# EAGLE design capv0 (EAGLE 6.5.0)
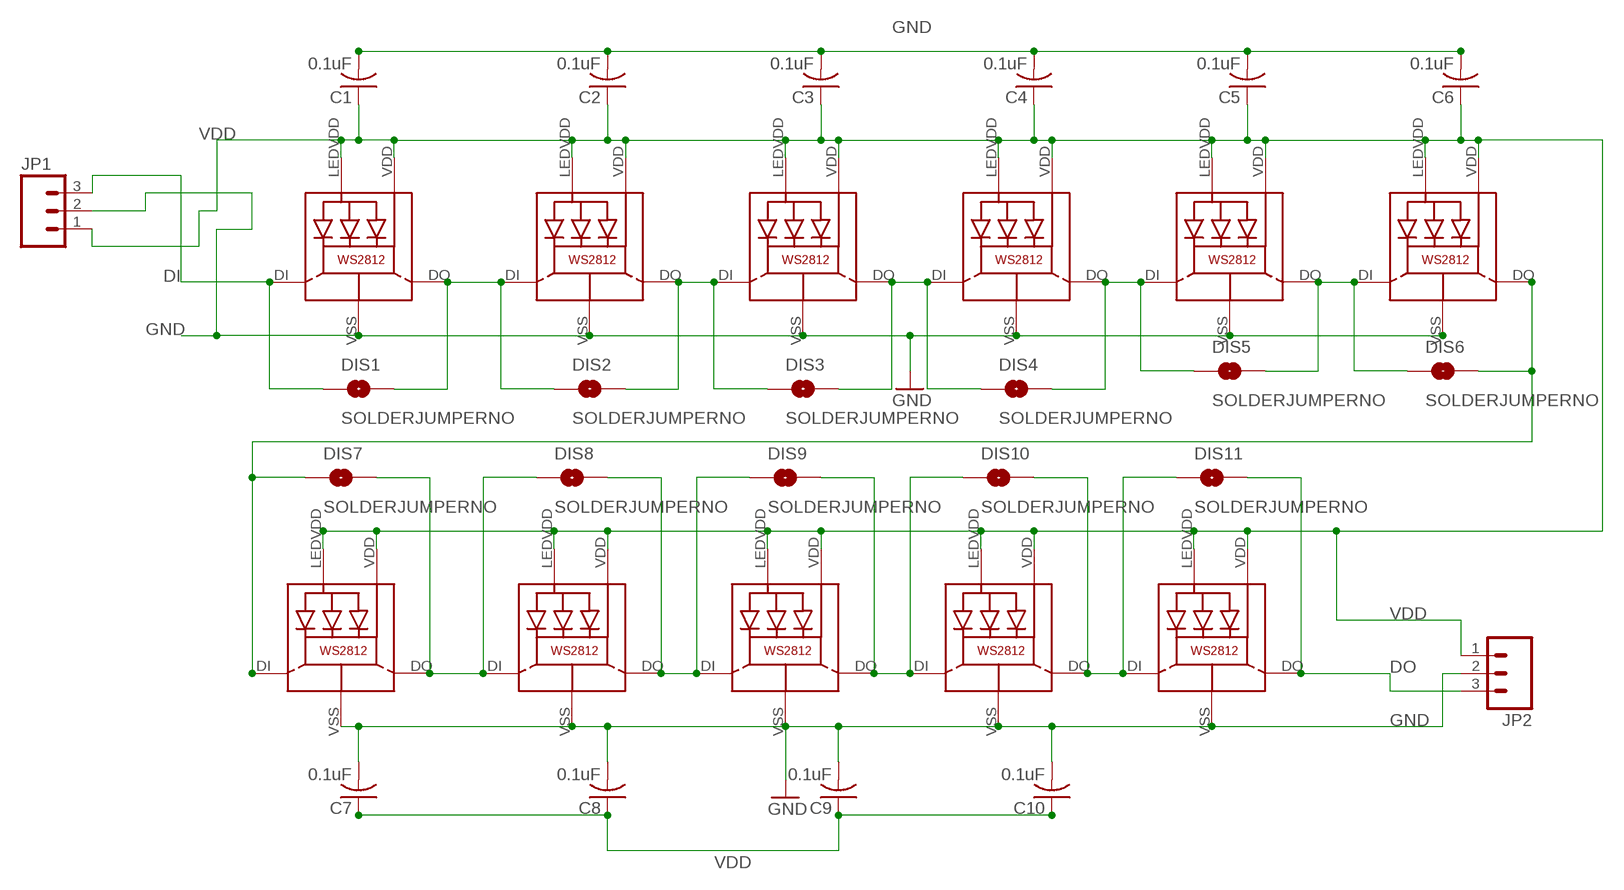
[diagram p0: schematic, sheet 1]

## Parts
C1  0.1uF  C-USC0805  [C0805]
C2  0.1uF  C-USC0805  [C0805]
C3  0.1uF  C-USC0805  [C0805]
C4  0.1uF  C-USC0805  [C0805]
C5  0.1uF  C-USC0805  [C0805]
C6  0.1uF  C-USC0805  [C0805]
C7  0.1uF  C-USC0805  [C0805]
C8  0.1uF  C-USC0805  [C0805]
C9  0.1uF  C-USC0805  [C0805]
C10  0.1uF  C-USC0805  [C0805]
DIS1  SOLDERJUMPERNO  [SJ_2S-NO]
DIS2  SOLDERJUMPERNO  [SJ_2S-NO]
DIS3  SOLDERJUMPERNO  [SJ_2S-NO]
DIS4  SOLDERJUMPERNO  [SJ_2S-NO]
DIS5  SOLDERJUMPERNO  [SJ_2S-NO]
DIS6  SOLDERJUMPERNO  [SJ_2S-NO]
DIS7  SOLDERJUMPERNO  [SJ_2S-NO]
DIS8  SOLDERJUMPERNO  [SJ_2S-NO]
DIS9  SOLDERJUMPERNO  [SJ_2S-NO]
DIS10  SOLDERJUMPERNO  [SJ_2S-NO]
DIS11  SOLDERJUMPERNO  [SJ_2S-NO]
JP1  M03LOCK  [1X03_LOCK]
JP2  M03LOCK  [1X03_LOCK]
LED1  WS2812  [WS2812]
LED2  WS2812  [WS2812]
LED3  WS2812  [WS2812]
LED4  WS2812  [WS2812]
LED5  WS2812  [WS2812]
LED6  WS2812  [WS2812]
LED7  WS2812  [WS2812]
LED8  WS2812  [WS2812]
LED9  WS2812  [WS2812]
LED10  WS2812  [WS2812]
LED11  WS2812  [WS2812]

## Nets
DI: DIS1.1 JP1.3 LED1.DI
DO: DIS11.2 JP2.3 LED11.DO
GND: C1.2 C2.2 C3.2 C4.2 C5.2 C6.2 C7.2 C8.2 C9.2 C10.2 JP1.2 JP2.2 LED1.VSS(GND) LED2.VSS(GND) LED3.VSS(GND) LED4.VSS(GND) LED5.VSS(GND) LED6.VSS(GND) LED7.VSS(GND) LED8.VSS(GND) LED10.VSS(GND) LED11.VSS(GND)
N$1: DIS1.2 DIS2.1 LED1.DO LED2.DI
N$2: DIS2.2 DIS3.1 LED2.DO LED3.DI
N$3: DIS3.2 DIS4.1 LED3.DO LED4.DI
N$4: DIS4.2 DIS5.1 LED4.DO LED5.DI
N$5: DIS5.2 DIS6.1 LED5.DO LED6.DI
N$6: DIS6.2 DIS7.1 LED6.DO LED7.DI
N$7: DIS7.2 DIS8.1 LED7.DO LED8.DI
N$8: DIS8.2 DIS9.1 LED8.DO LED9.DI
N$9: DIS9.2 DIS10.1 LED9.DO LED10.DI
N$10: DIS10.2 DIS11.1 LED10.DO LED11.DI
VDD: C1.1 C2.1 C3.1 C4.1 C5.1 C6.1 C7.1 C8.1 C9.1 C10.1 JP1.1 JP2.1 LED1.LEDVDD LED1.VDD LED2.LEDVDD LED2.VDD LED3.LEDVDD LED3.VDD LED4.LEDVDD LED4.VDD LED5.LEDVDD LED5.VDD LED6.LEDVDD LED6.VDD LED7.LEDVDD LED7.VDD LED8.LEDVDD LED8.VDD LED9.LEDVDD LED9.VDD LED10.LEDVDD LED10.VDD LED11.LEDVDD LED11.VDD

## Power pins joined to a net without a drawn wire
GND: LED9.VSS(GND)

## Library data of the parts
C1-C10 = adafruit:C-US: CAPACITOR, American symbol
DIS1-DIS11 = SparkFun-Passives:SOLDERJUMPER: Solder Jumper Standard SMD solder jumper. Used to automate production. Two varients : Normally Open and Normally Closed are the same, but have different paste layers. NC will have a large amount of paste and should jumper during reflow.
JP1 JP2 = SparkFun-Connectors:M03: Header 3 Standard 3-pin 0.1" header. Use with straight break away headers (SKU : PRT-00116), right angle break away headers (PRT-00553), swiss pins (PRT-00743), machine pins (PRT-00117), and female headers (PRT-00115). Molex polarized connector foot print use with SKU : PRT-08232 with associated crimp pins and housings.
LED1-LED11 = adafruit:WS2812

## Board
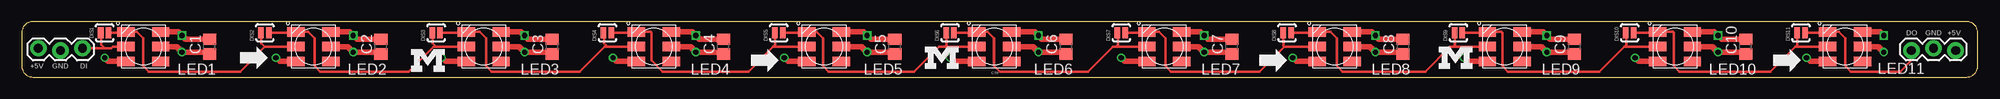
[diagram p1: board, top side]
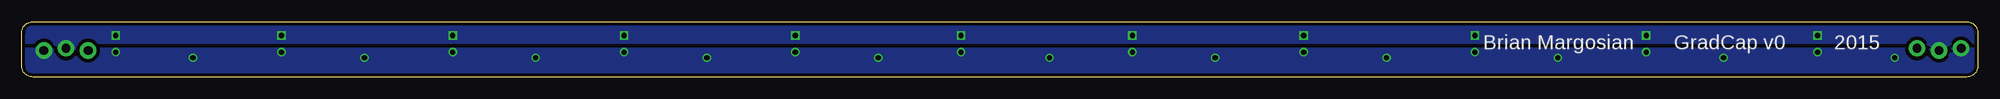
[diagram p2: board, bottom side, seen from below]

Size 224.79 x 6.35 mm. Coordinates in mm from the lower left corner, seen from the top.
Outline: 0,5.08 0,1.27 arc90 1.27,0 223.52,0 arc90 224.79,1.27 224.79,5.08 arc90 223.52,6.35 1.27,6.35 arc90 0,5.08
Copper layers (1*16): Top 0.0356mm / dielectric 1.5011mm / Bottom 0.0356mm
Design rules "OshPark2014": minimum track width 6mil, minimum drill 13mil, track to track 6mil, track to pad 6mil, pad to pad 6mil, via to via 6mil, smd to smd 6mil, copper to edge 15mil, drill to drill 6mil, minimum pad ring 7mil, minimum via ring 7mil, stop-mask expansion 3mil, vias tented up to drill 0mil, thermal gap 10mil

### Footprints (pad centres in the part's own frame; a part is rotated, then mirrored left to right if it is on the bottom)
C0805 = smd 1.3 x 1.5: 1 -0.85,0; 2 0.85,0
SJ_2S-NO = smd 0.635 x 1.27: 1 -0.45,0; 2 0.45,0
1X03_LOCK = drill 1.016 pad 1.88: 1 0,0.127; 2 2.54,-0.127; 3 5.08,0.127
WS2812 = smd 2 x 1.1: DI 2,0; DO 2,-1.7; LEDVDD -2,0; NC -2,1.7; VDD 2,1.7; VSS -2,-1.7

### Placement (x,y rotation side)
C1  21.59,3.49 90 top
C2  41.27,3.49 90 top
C3  60.96,3.49 90 top
C4  80.64,3.49 90 top
C5  100.33,3.49 90 top
C6  120.02,3.49 90 top
C7  139.06,3.49 90 top
C8  158.75,3.49 90 top
C9  178.44,3.49 90 top
C10  198.12,3.49 90 top
DIS1  9.53,5.08 0 top
DIS2  27.94,5.08 0 top
DIS3  47.62,5.08 0 top
DIS4  67.31,5.08 0 top
DIS5  87,5.08 0 top
DIS6  106.68,5.08 0 top
DIS7  126.36,5.08 0 top
DIS8  145.41,5.08 0 top
DIS9  165.1,5.08 0 top
DIS10  184.78,5.08 0 top
DIS11  204.47,5.08 0 top
JP1  1.91,3.17 0 top
JP2  222.25,3.17 180 top
LED1  13.97,3.49 180 top
LED2  33.53,3.49 180 top
LED3  53.09,3.49 180 top
LED4  72.64,3.49 180 top
LED5  92.2,3.49 180 top
LED6  111.76,3.49 180 top
LED7  131.32,3.49 180 top
LED8  150.88,3.49 180 top
LED9  170.43,3.49 180 top
LED10  189.99,3.49 180 top
LED11  209.55,3.49 180 top

### Tracks (layer width: path | path; a pad name or v marks a point on that pad's centre or on a via)
DI
  Top 0.305: JP1.3 9.53,3.3 | 9.53,3.3 10.29,3.3 10.48,3.49 LED1.DI | DIS1.1 9.12,3.7 9.53,3.3
DO
  Top 0.305: JP2.3 217.17,1.91 215.9,0.64 210.19,0.64 209.55,1.27 209.55,4.45 208.8,5.19 LED11.DO 207.44,5.08 DIS11.2
GND  (via drill 0.6)
  Top 0.61: LED1.VSS 17.98,5.19 v18.41,4.76 18.84,4.34 C1.2 | LED2.VSS 37.67,5.19 v38.1,4.76 38.52,4.34 C2.2 | LED3.VSS 57.35,5.19 v57.78,4.76 58.2,4.34 C3.2 | LED4.VSS 77.04,5.19 v77.47,4.76 77.89,4.34 C4.2 | LED5.VSS 96.72,5.19 v97.16,4.76 97.58,4.34 C5.2 | LED6.VSS 116.41,5.19 v116.84,4.76 117.26,4.34 C6.2 | LED7.VSS 135.46,5.19 v135.89,4.76 136.31,4.34 C7.2 | LED8.VSS 155.15,5.19 v155.57,4.76 156,4.34 C8.2 | LED9.VSS 174.83,5.19 v175.26,4.76 175.68,4.34 C9.2 | LED10.VSS 194.51,5.19 v194.94,4.76 195.37,4.34 C10.2 | LED11.VSS 213.56,5.19 v214,4.76
  pour Bottom (isolate 0.406, rank 2): 0,3.17 0,6.35 224.79,6.35 224.79,3.17
  pour Bottom (no thermals): 3.17,3.81 4.45,3.17 5.71,3.81 5.08,4.45 3.81,4.45
  pour Bottom (no thermals): 220.98,3.81 219.71,3.17 218.44,3.81 219.07,4.45 220.98,4.45
N$1
  Top 0.305: 27.94,3.49 25.08,0.64 14.61,0.64 13.97,1.27 13.97,4.45 13.22,5.19 LED1.DO 11.86,5.08 DIS1.2 | 27.94,3.49 LED2.DI | DIS2.1 27.54,3.89 27.94,3.49
N$2
  Top 0.305: 47.62,3.49 47.31,3.49 44.45,0.64 34.29,0.64 33.66,1.27 33.66,4.45 32.91,5.19 LED2.DO 31.42,5.08 DIS2.2 | 47.62,3.49 LED3.DI | DIS3.1 47.22,3.89 47.62,3.49
N$3
  Top 0.305: 67.31,3.49 66.99,3.49 64.14,0.64 53.98,0.64 53.34,1.27 53.34,4.45 52.59,5.19 LED3.DO 50.97,5.08 DIS3.2 | 67.31,3.49 LED4.DI | DIS4.1 66.91,3.89 67.31,3.49
N$4
  Top 0.305: 86.36,3.49 83.5,0.64 73.66,0.64 72.39,1.91 72.39,5.08 72.28,5.19 LED4.DO 70.53,5.08 DIS4.2 | 86.36,3.49 LED5.DI | DIS5.1 86.59,3.73 86.36,3.49
N$5
  Top 0.305: 106.05,3.49 105.41,3.49 102.55,0.64 92.71,0.64 92.08,1.27 92.08,4.45 91.33,5.19 LED5.DO 90.09,5.08 DIS5.2 | 106.05,3.49 LED6.DI | DIS6.1 106.28,3.73 106.05,3.49
N$6
  Top 0.305: 125.73,3.49 125.41,3.49 122.56,0.64 112.39,0.64 111.76,1.27 111.76,4.45 111.01,5.19 LED6.DO 109.65,5.08 DIS6.2 | 125.73,3.49 LED7.DI | DIS7.1 125.96,3.73 125.73,3.49
N$7
  Top 0.305: 145.1,3.49 142.24,0.64 132.08,0.64 131.44,1.27 131.44,4.45 130.7,5.19 LED7.DO 129.21,5.08 DIS7.2 | 145.1,3.49 LED8.DI | DIS8.1 145.01,3.58 145.1,3.49
N$8
  Top 0.305: 164.47,3.49 164.15,3.49 161.29,0.64 151.76,0.64 151.13,1.27 151.13,4.45 150.38,5.19 LED8.DO 148.76,5.08 DIS8.2 | 164.47,3.49 LED9.DI | DIS9.1 164.7,3.73 164.47,3.49
N$9
  Top 0.305: 184.15,3.49 181.29,0.64 170.81,0.64 170.18,1.27 170.18,5.08 170.07,5.19 LED9.DO 168.32,5.08 DIS9.2 | 184.15,3.49 LED10.DI | DIS10.1 184.38,3.73 184.15,3.49
N$10
  Top 0.305: 203.84,3.49 200.98,0.64 190.5,0.64 189.87,1.27 189.87,5.08 189.75,5.19 LED10.DO 187.88,5.08 DIS10.2 | 203.84,3.49 LED11.DI | DIS11.1 204.07,3.73 203.84,3.49
VDD  (via drill 0.6)
  Top 0.61: LED1.LEDVDD 17.78,3.49 v18.41,2.86 21.38,2.86 C1.1 | LED1.VDD 9.96,1.79 v9.53,2.22 | LED2.VDD 29.64,1.79 v29.21,2.22 | LED2.LEDVDD 37.47,3.49 v38.1,2.86 41.06,2.86 C2.1 | LED3.VDD 48.69,1.79 v48.26,2.22 | LED3.LEDVDD 57.15,3.49 v57.78,2.86 60.74,2.86 C3.1 | LED4.VDD 68.38,1.79 v67.94,2.22 | LED4.LEDVDD 76.83,3.49 v77.47,2.86 80.43,2.86 C4.1 | LED5.VDD 88.06,1.79 v87.63,2.22 | LED5.LEDVDD 96.52,3.49 v97.16,2.86 100.11,2.86 C5.1 | LED6.VDD 107.11,1.79 v106.68,2.22 | LED6.LEDVDD 116.2,3.49 v116.84,2.86 119.8,2.86 C6.1 | LED7.VDD 126.8,1.79 v126.36,2.22 | LED7.LEDVDD 135.25,3.49 v135.89,2.86 138.85,2.86 C7.1 | LED8.VDD 146.48,1.79 v146.05,2.22 | LED8.LEDVDD 154.94,3.49 v155.57,2.86 158.53,2.86 C8.1 | LED9.VDD 166.16,1.79 v165.74,2.22 | LED9.LEDVDD 174.62,3.49 v175.26,2.86 178.22,2.86 C9.1 | LED10.VDD 185.85,1.79 v185.42,2.22 | LED10.LEDVDD 194.31,3.49 v194.94,2.86 197.91,2.86 C10.1 | LED11.VDD 205.53,1.79 v205.1,2.22 | LED11.LEDVDD 213.36,3.49 v214,2.86
  pour Bottom (isolate 0.406): 0,3.17 0,0 224.79,0 224.79,3.17
  pour Bottom (rank 2, no thermals): 1.91,3.17 0.64,3.17 0.64,1.91 3.17,1.91 3.17,2.54
  pour Bottom (rank 2, no thermals): 222.25,3.17 220.98,2.54 220.98,1.91 221.62,1.27 223.52,1.27 224.16,3.17

### Text on the board
tNames: DO | GND | +5V | +5V | GND | DI | CTR
bNames: 2015 | GradCap v0 | Brian Margosian